# EAGLE design 206_uv (EAGLE 9.6.2)
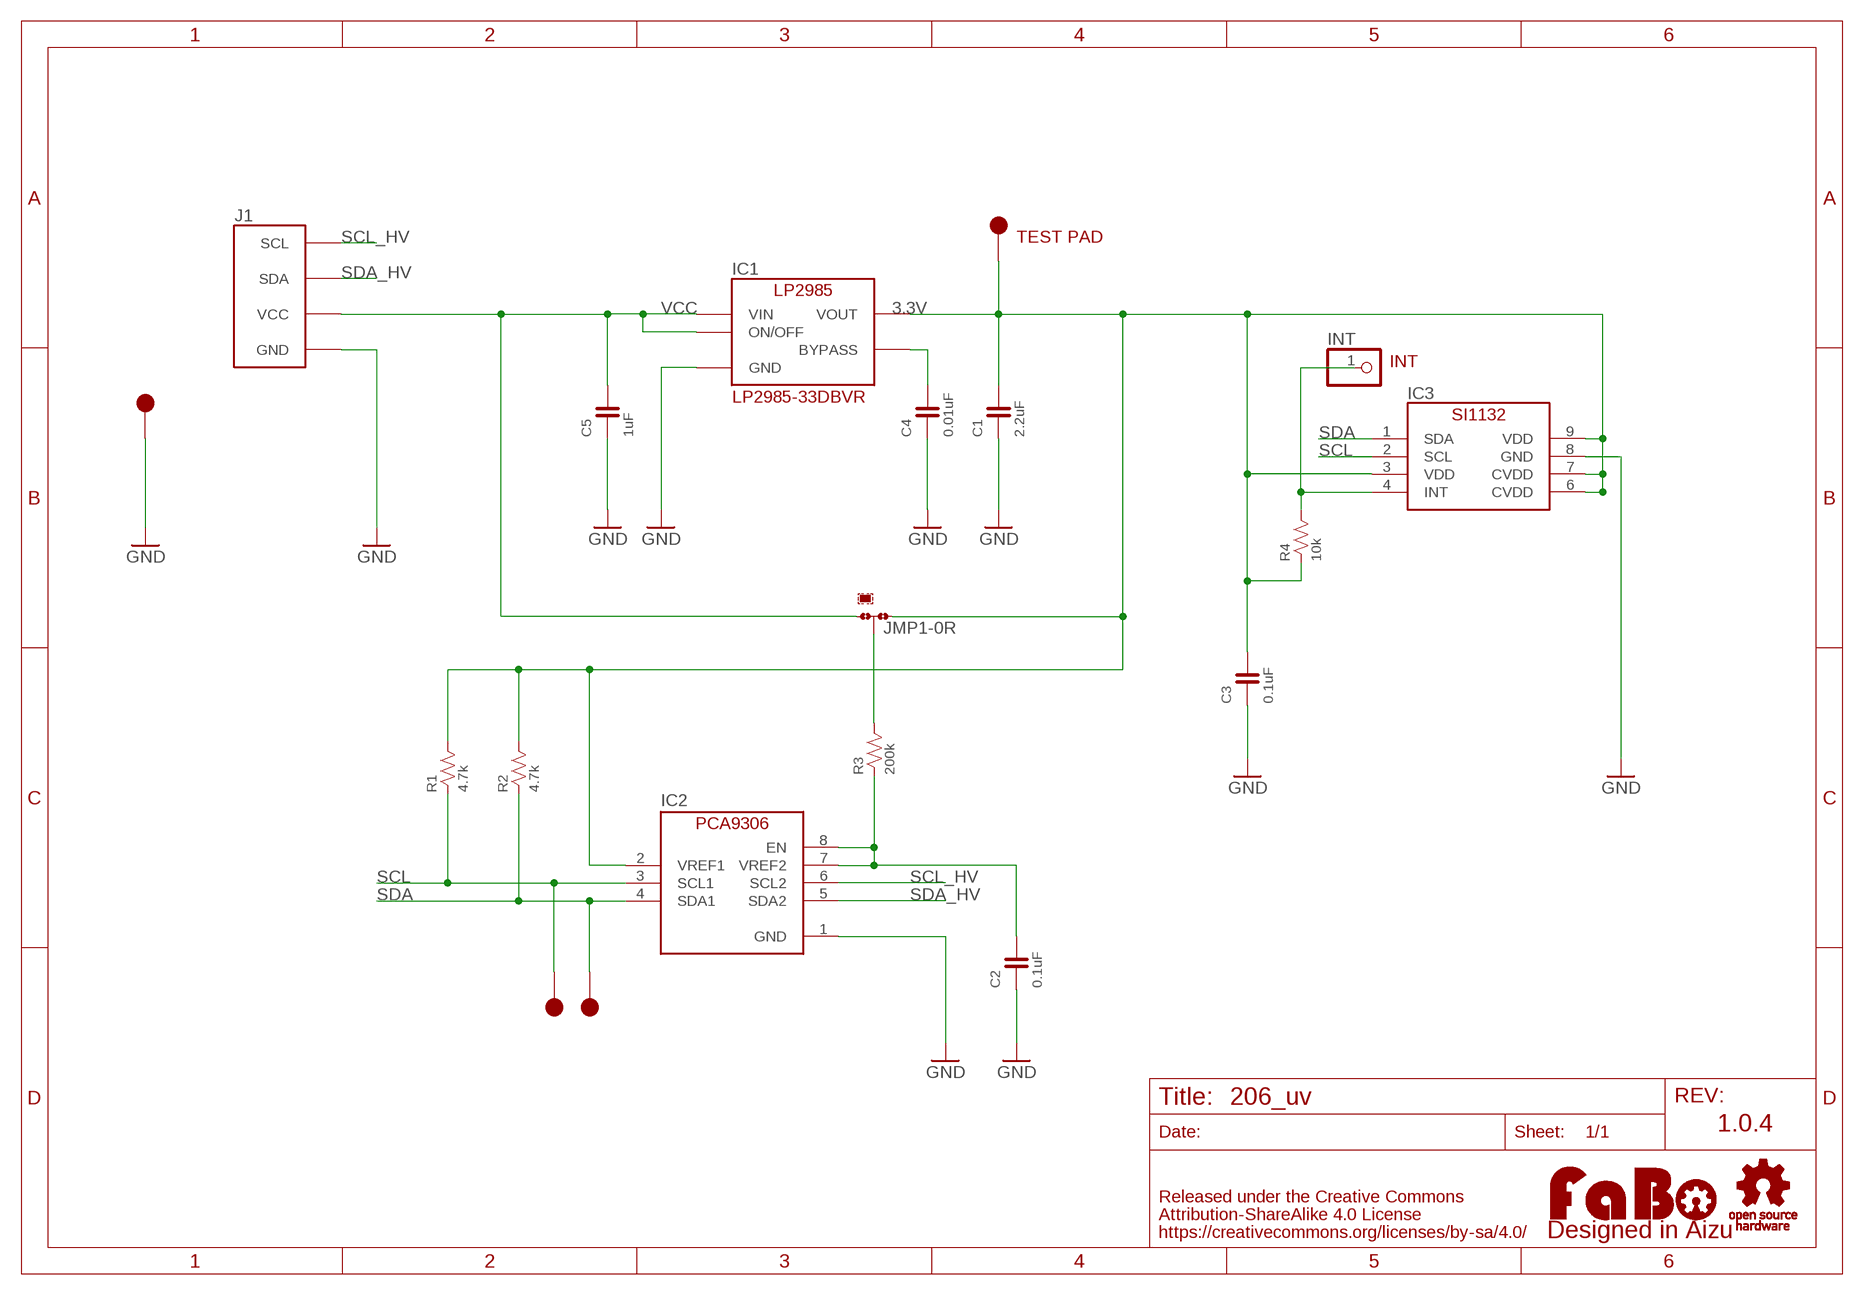
[diagram p0: schematic, sheet 1]

## Parts
C1  2.2uF  CAPACITOR-0603  [0603]
C2  0.1uF  CAPACITOR-0603  [0603]
C3  0.1uF  CAPACITOR-0603  [0603]
C4  0.01uF  CAPACITOR-0603  [0603]
C5  1uF  CAPACITOR-0603  [0603]
IC1  LP2985-33DBV  [SOT-23-5]
IC2  PCA9306GM  [XQFN8]
IC3  SL-SI1132  [SILICONLABS-SI1132]
INT  PINHD-1X1  [1X01]
J1  FABO_BRICK_I2C  [FABO_BRICK_I2C]
JMP1  0R-JUMPB  [B0R-JMP]
LOGO1  LOGO_FABO-M  [LOGO_FABO_M]
R1  4.7k  RESISTOR-0603  [0603]
R2  4.7k  RESISTOR-0603  [0603]
R3  200k  RESISTOR-0603  [0603]
R4  10k  RESISTOR-0603  [0603]
TP1  TP-15  [TP-15]
TP2  TP-15  [TP-15]
TP3  TP-15  [TP-15]
TP4  TP-15  [TP-15]
U$3  LOGO_OSHW-M_BOTTOM  [LOGO_OSHW_M_BOTTOM]

## Nets
3.3V: C1.2 C3.2 IC1.5(VOUT) IC2.2(VREF1) IC3.3(VDD) IC3.6(CVDD) IC3.7(CVDD) IC3.9(VDD) JMP1.1 R1.2 R2.2 R4.1 TP4.1
GND: C1.1 C2.1 C3.1 C4.1 C5.1 IC1.2(GND) IC2.1(GND) IC3.8(GND) J1.GND TP3.1
N$1: C2.2 IC2.7(VREF2) IC2.8(EN) R3.1
N$2: C4.2 IC1.4(BYPASS)
N$3: JMP1.2 R3.2
N$6: IC3.4(INT) INT.1 R4.2
SCL: IC2.3(SCL1) IC3.2(SCL) R1.1 TP2.1
SCL_HV: IC2.6(SCL2) J1.SCL
SDA: IC2.4(SDA1) IC3.1(SDA) R2.1 TP1.1
SDA_HV: IC2.5(SDA2) J1.SDA
VCC: C5.2 IC1.1(VIN) IC1.3(ON/OFF) J1.VCC JMP1.3

## Notes on the sheet
- TEST PAD
- INT
- LP2985-33DBVR
- 1.0.4

## Library data of the parts
C1-C5 = FaBo-Capacitor:CAPACITOR: CAPACITOR
IC1 = FaBo-Supply:LP2985: LP2985
IC2 = FaBo-LevelTranslator:PCA9306
IC3 = FaBo-Mems:SL-SI1132: SiliconLabs SI1131(UV Index sensor)
INT = pinhead:PINHD-1X1: PIN HEADER
J1 = FaBo-Template:FABO_BRICK_I2C: FaBo Brick I2C
JMP1 = jump-0r-smd:0R-JUMP: SMD 0R 0805 Jumper
LOGO1 = component:LOGO_FABO
R1-R4 = FaBo-Resistors:RESISTOR: RESISTOR
TP1-TP4 = FaBo-Supply:TP
U$3 = FaBo-etc:LOGO_OSHW

## Board
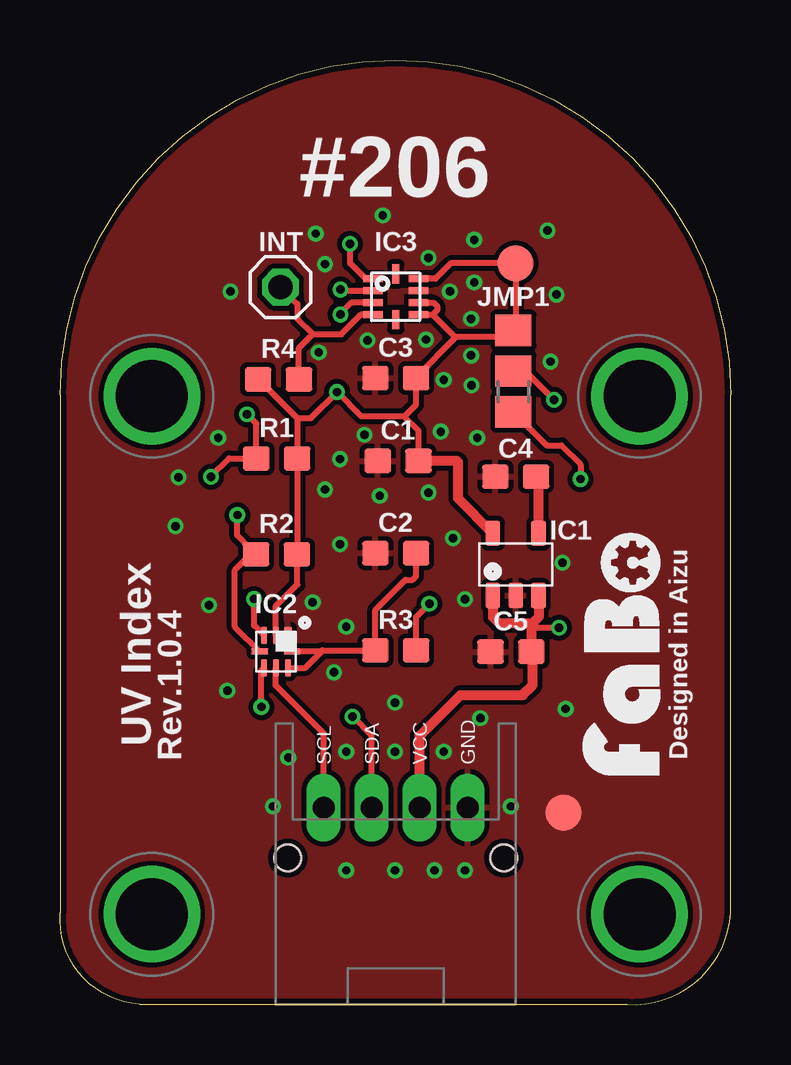
[diagram p1: board, top side]
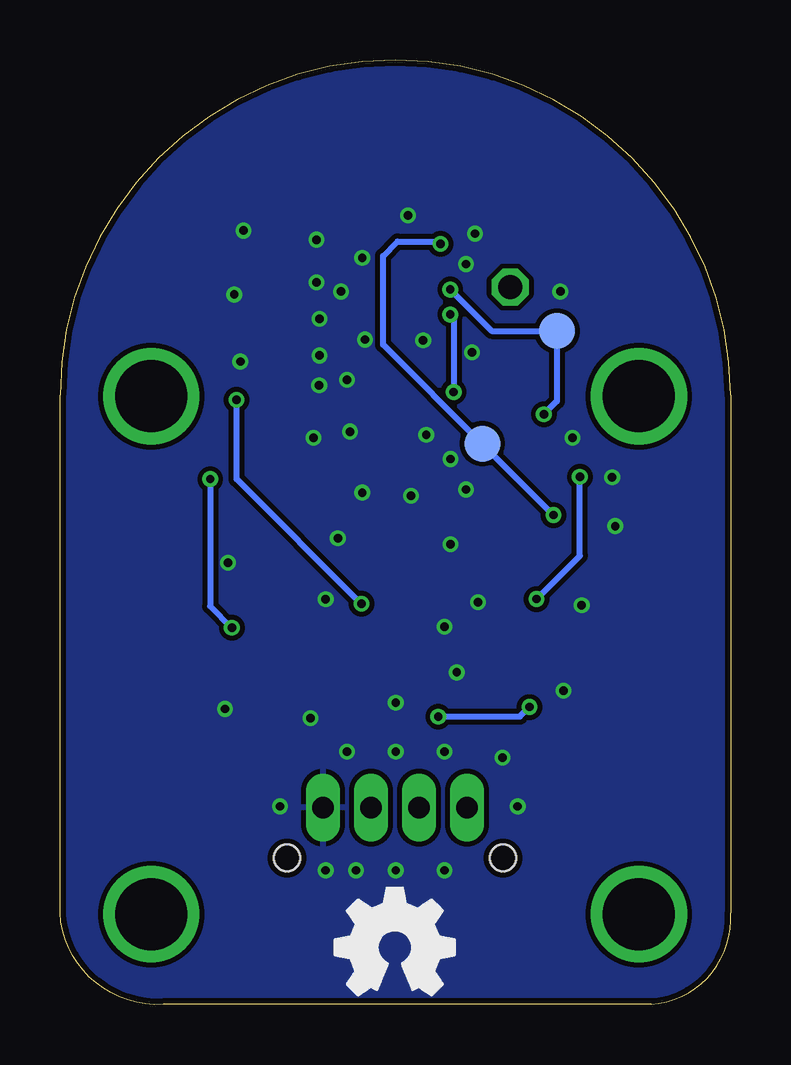
[diagram p2: board, bottom side, seen from below]

Size 27.95 x 39.38 mm. Coordinates in mm from the lower left corner, seen from the top.
Copper layers (1*16): Top 0.035mm / dielectric 1.6mm / Bottom 0.035mm
Design rules "PCBway": minimum track width 6mil, minimum drill 12mil, track to track 6mil, track to pad 6mil, pad to pad 6mil, via to via 6mil, smd to smd 6mil, copper to edge 10mil, drill to drill 10mil, minimum pad ring 10mil, minimum via ring 6mil, stop-mask expansion 2mil, vias tented up to drill 100mil, thermal gap 8mil

### Footprints (pad centres in the part's own frame; a part is rotated, then mirrored left to right if it is on the bottom)
0603 = smd 1.1 x 1: 1 -0.85,0; 2 0.85,0
SOT-23-5 = smd 0.6 x 1.05: 1 -0.95,-1.3; 2 0,-1.3; 3 0.95,-1.3; 4 0.95,1.3; 5 -0.95,1.3
XQFN8 = smd 0.7 x 0.35: 1 -0.675,0.5 | smd 0.7 x 0.25: 2 -0.675,0; 3 -0.675,-0.5; 5 0.675,-0.5; 6 0.675,0; 7 0.675,0.5 | smd 0.25 x 0.7: 4 0,-0.675; 8 0,0.675
SILICONLABS-SI1132 = smd 0.8 x 0.3: 1 -0.95,0.752; 2 -0.95,0.252; 3 -0.95,-0.248; 4 -0.95,-0.748; 6 0.95,-0.748; 7 0.95,-0.248; 8 0.95,0.252; 9 0.95,0.752 | smd 0.3 x 0.8: 5 0,-0.95; 10 0,0.95
1X01 = drill 1.016 octagon: 1 0,0
FABO_BRICK_I2C = drill 0.9 pad 1.422 long: GND 3,-10.795; SCL -3,-10.795; SDA -1,-10.795; VCC 1,-10.795 | drill 3 pad 3.81: P$1 -10.16,6.35; P$2 10.16,6.35; P$3 -10.16,-15.24; P$4 10.16,-15.24 | hole 1.1: -4.5,-12.895; 4.5,-12.895
B0R-JMP = smd 1.5 x 1.3: 1 0,1.7; 2 0,0; 3 0,-1.7
TP-15 = smd 1.5 x 1.5: 1 0,0

### Placement (x,y rotation side)
C1  14.09,22.67 0 top
C2  13.99,18.82 0 top
C3  13.99,26.12 0 top
C4  18.99,22.01 0 top
C5  18.79,14.71 0 top
IC1  18.99,18.35 0 top
IC2  9,14.72 270 top
IC3  13.99,29.51 0 top
INT  9.19,29.91 0 top
J1  13.99,19.01 0 top
JMP1  18.89,26.41 0 top
LOGO1  25.39,14.61 90 top
R1  9.03,22.77 0 top
R2  9.02,18.77 0 top
R3  13.99,14.77 0 top
R4  9.11,26.07 0 top
TP1  10.35,23.38 0 bottom
TP2  7.24,28.08 0 bottom
TP3  20.99,8.01 0 top
TP4  18.99,30.91 0 top
U$3  13.99,2.39 0 top
U$4  [FABO_BRICK_I2C_OUTTER]  13.99,14.28 0 top

### Tracks (layer width: path | path; a pad name or v marks a point on that pad's centre or on a via)
3.3V  (via drill 0.35)
  Top 0.254: R4.1 9.88,24.45 | 9.88,24.45 R1.2 R2.2 9.89,18.75 9.89,17.51 9,16.62 IC2.2 | IC3.3 12.14,29.26 11.69,28.81 v11.69,28.76 | IC3.9 15.64,30.26 16.29,30.91 TP4.1 | 9.88,24.45 10.46,24.45 v11.54,25.53 12.56,24.52 14.34,24.52 | 14.34,24.52 14.84,25.02 C3.2 14.84,26.16 16.5,27.82 | C1.2 14.94,23.92 14.34,24.52 | IC3.6 15.53,28.76 | 18.89,30.81 TP4.1 | IC3.7 15.57,29.26 15.74,29.09 15.74,28.96 15.53,28.76 | 15.53,28.76 16.47,27.82 16.5,27.82 | 16.5,27.82 18.6,27.82 JMP1.1 18.99,28.21 TP4.1
  Top 0.406: IC1.5 16.59,21.1 16.59,22.61 16.53,22.67 C1.2
  Bottom 0.254: v11.69,28.76 11.54,28.62 v11.54,25.53
GND  (via drill 0.35)
  other vias: 16.24,29.72 12.81,27.69 17.26,30.1 17.13,27.06 17.15,25.81 15.24,27.72 10.78,27.18 12.69,23.75 15.35,21.34 11.04,21.47 17.26,31.88 11.67,22.74 17.13,28.58 15.35,31.12 15.99,26.04 15.86,23.88 17.39,23.63 20.43,26.8 20.69,29.6 20.31,32.26 11.04,30.87 13.45,32.9 10.66,32.14 7.1,29.72 13.32,21.21 16.37,19.44 20.94,18.42 16.88,16.9 13.96,12.58 11.93,15.75 10.53,16.77 11.67,19.18 11.42,13.85 21.07,12.32 17.51,11.94 11.93,10.55 13.96,10.55 15.99,10.55 9.51,10.29 6.97,13.09 6.21,16.64 4.81,19.94 4.94,21.98 6.59,23.63 16.88,5.59 15.61,5.59 13.96,5.59 11.93,5.59 8.88,8.26 18.78,8.26
  pour Top (isolate 0.203): -0.01,0.01 -0.01,39.38 27.93,39.38 27.93,0.01
  pour Bottom (isolate 0.203): -0.01,0.01 -0.01,39.38 27.93,39.38 27.93,0.01
N$1
  Top 0.254: IC2.7 10.22,14.04 10.89,14.71 | 10.89,14.71 10.88,14.72 IC2.8 | 10.89,14.71 10.95,14.77 R3.1 13.14,16.46 14.39,17.71 14.69,17.71 14.84,17.86 C2.2
N$2
  Top 0.406: IC1.4 19.94,21.91 C4.2
N$3  (via drill 0.35)
  Top 0.254: R3.2 14.84,16.16 v15.39,16.71 | v20.59,25.21 19.39,26.41 JMP1.2
  Bottom 0.254: v15.39,16.71 20.59,21.91 v20.59,25.21
N$6
  Top 0.254: IC3.4 12.54,28.76 11.73,27.95 10.53,27.95 | R4.2 9.96,27.37 10.53,27.95 | INT.1 9.89,29.2 9.89,28.58 10.53,27.95
SCL  (via drill 0.35)
  Top 0.254: v7.79,24.61 8.18,24.22 R1.1 7.05,22.77 v6.29,22.01 | v11.69,29.81 11.74,29.76 IC3.2 | IC2.3 8.09,15.8 v8.09,16.91
  Bottom 0.254: v8.09,16.91 6.29,18.71 v6.29,22.01 | v7.79,24.61 7.24,25.15 TP2.1 9.96,28.08 v11.69,29.81
SCL_HV
  Top 0.254: J1.SCL 10.99,11.31 8.99,13.31 8.99,14.03 IC2.6
SDA  (via drill 0.35)
  Top 0.254: R2.1 7.96,18.98 | 7.96,18.98 7.39,19.55 v7.39,20.41 | IC3.1 12.74,30.26 12.09,30.91 v12.09,31.71 | IC2.4 7.29,15.75 7.29,18.11 7.96,18.78 7.96,18.98
  Bottom 0.254: v7.39,20.41 10.25,23.27 10.35,23.37 | 10.35,23.37 14.49,27.51 14.49,31.21 13.89,31.81 12.19,31.81 v12.09,31.71 | TP1.1 10.35,23.37
SDA_HV  (via drill 0.35)
  Top 0.254: J1.SDA 12.99,11.21 v12.19,12.01 | v8.39,12.41 8.39,13.93 IC2.5
  Bottom 0.254: v12.19,12.01 8.79,12.01 v8.39,12.41
VCC  (via drill 0.35)
  Top 0.254: JMP1.3 20.29,23.31 20.89,23.31 21.69,22.51 v21.69,21.91 | v20.79,15.71 19.69,15.71 19.64,15.76
  Top 0.406: IC1.1 18.04,16.16 18.29,15.91 19.49,15.91 19.59,15.81 | 19.59,15.81 19.64,15.76 C5.2 19.69,14.66 19.69,13.31 19.29,12.91 16.69,12.91 14.99,11.21 J1.VCC | IC1.3 19.94,16.16 19.59,15.81
  Bottom 0.254: v21.69,21.91 21.69,16.61 v20.79,15.71

### Text on the board
tPlace: #206 | UV Index | Designed in Aizu | Rev.1.0.4